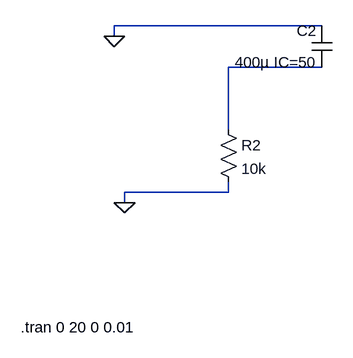
[diagram p0: schematic project.asc]
project.asc, the LTspice schematic file:
Version 4
SHEET 1 880 680
WIRE 576 32 256 32
WIRE 256 48 256 32
WIRE 576 96 432 96
WIRE 432 192 432 96
WIRE 432 288 432 272
WIRE 432 288 272 288
WIRE 272 304 272 288
FLAG 256 48 0
FLAG 272 304 0
SYMBOL Res 416 176 R0
SYMATTR InstName R2
SYMATTR Value 10k
SYMBOL Cap 592 96 R180
WINDOW 0 24 56 Left 2
WINDOW 3 24 8 Left 2
SYMATTR InstName C2
SYMATTR Value 400µ IC=50
TEXT 112 496 Left 2 !.tran 0 20 0 0.01

The netlist it stands for:
* project.asc
R2 N001 0 10k
C2 N001 0 400µ IC=50
.tran 0 20 0 0.01
.backanno
.end